# EAGLE design Chronograph (EAGLE 9.2.2)
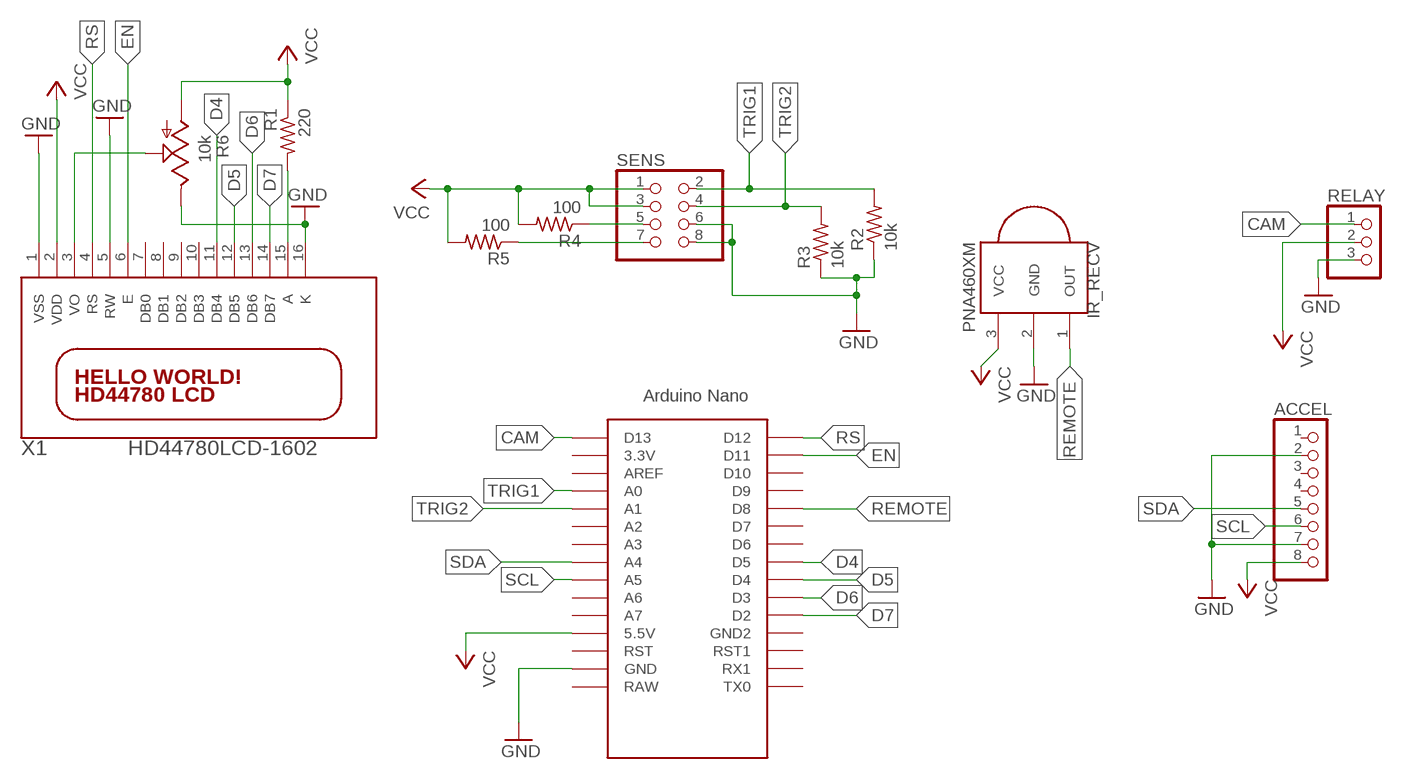
[diagram p0: schematic, sheet 1]

## Parts
ACCEL  PINHD-1X8BIG  [1X08-BIG]
IR_RECV  PNA460XM  [PNA460XM]
R1  220  R-US_0204/7  [0204/7]
R2  10k  R-US_0204/7  [0204/7]
R3  10k  R-US_0204/7  [0204/7]
R4  100  R-US_0204/7  [0204/7]
R5  100  R-US_0204/7  [0204/7]
R6  10k  TRIM_US-B64Y  [B64Y]
RELAY  PINHD-1X3  [1X03]
SENS  PINHD-2X4  [2X04]
U$1  NANO  [NANO]
X1  HD44780LCD-1602  [LCD1602]

## Nets
CAM: RELAY.1 U$1.D13
D4: U$1.D5 X1.11(DB4)
D5: U$1.D4 X1.12(DB5)
D6: U$1.D3 X1.13(DB6)
D7: U$1.D2 X1.14(DB7)
EN: U$1.D11 X1.6(E)
GRN: ACCEL.2 ACCEL.7 IR_RECV.2(GND) R2.1 R3.1 R6.E RELAY.3 SENS.6 SENS.8 U$1.GND X1.1(VSS) X1.5(RW) X1.16(K) ; supply symbol labelled GND
N$1: R1.2 X1.15(A)
N$2: R5.1 SENS.7
N$3: R4.1 SENS.5
N$4: R6.S X1.3(VO)
REMOTE: IR_RECV.1(OUT) U$1.D8
RS: U$1.D12 X1.4(RS)
SCL: ACCEL.6 U$1.A5
SDA: ACCEL.5 U$1.A4
TRIG1: R2.2 SENS.2 U$1.A0
TRIG2: R3.2 SENS.4 U$1.A1
VCC: ACCEL.8 IR_RECV.3(VCC) R1.1 R4.2 R5.2 R6.A RELAY.2 SENS.1 SENS.3 U$1.5V(5.5V) X1.2(VDD)
Unconnected: ACCEL.1 ACCEL.3 ACCEL.4 U$1.3.3V U$1.A2 U$1.A3 U$1.A6 U$1.A7 U$1.AREF U$1.D6 U$1.D7 U$1.D9 U$1.D10 U$1.GND1(GND2) U$1.ICSP1 U$1.ICSP2 U$1.ICSP3 U$1.ICSP4 U$1.ICSP5 U$1.ICSP6 U$1.RAW U$1.RST U$1.RST1 U$1.RX1 U$1.TX0 X1.7(DB0) X1.8(DB1) X1.9(DB2) X1.10(DB3)

## Library data of the parts
ACCEL = adafruit:PINHD-1X8: PIN HEADER
IR_RECV = adafruit:PNA460XM: IR 38KHz receiver PNA4602 and related receivers http://www.ladyada.net/library/pcb/eaglelibrary.html
R1-R5 = adafruit:R-US_: RESISTOR, American symbol
R6 = pot:TRIM_US-: POTENTIOMETER
RELAY = adafruit:PINHD-1X3: PIN HEADER
SENS = adafruit:PINHD-2X4: PIN HEADER
U$1 = Arduino-clone:NANO: Arduino Nano
X1 = adafruit:HD44780LCD: HD44780 LCD Standard character type LCDs, available in sizes from 8x1 to 40x4!

## Net classes
0 default: width 0.305 mm, drill 0.508 mm, clearance 0.254 mm

## Board
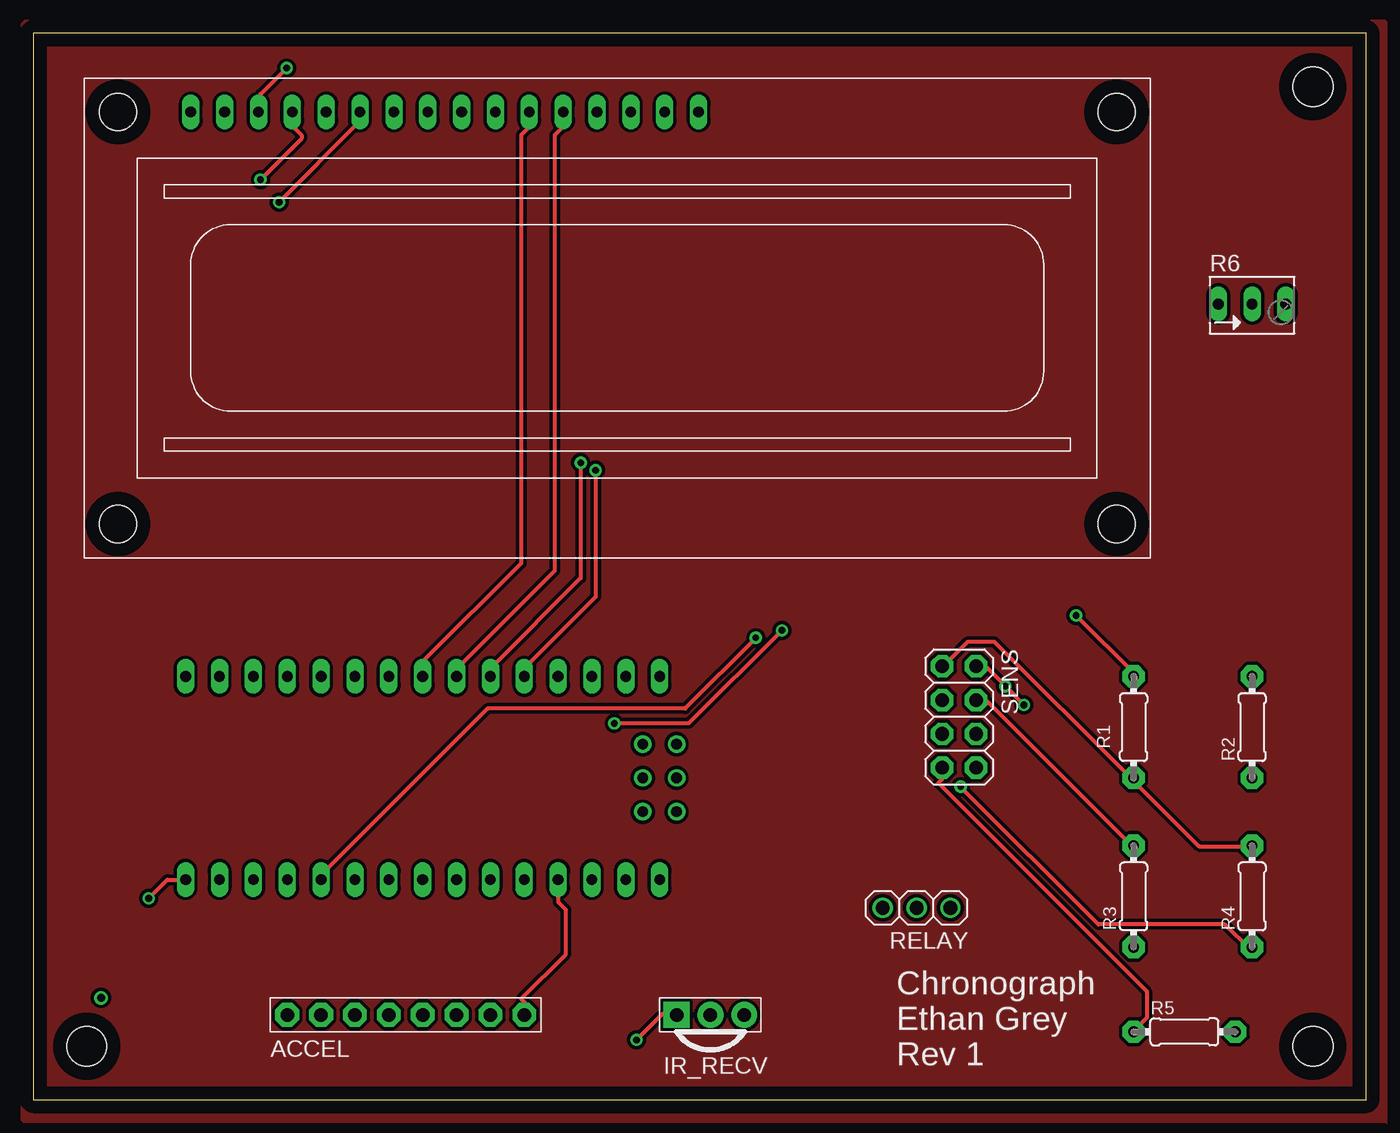
[diagram p1: board, top side]
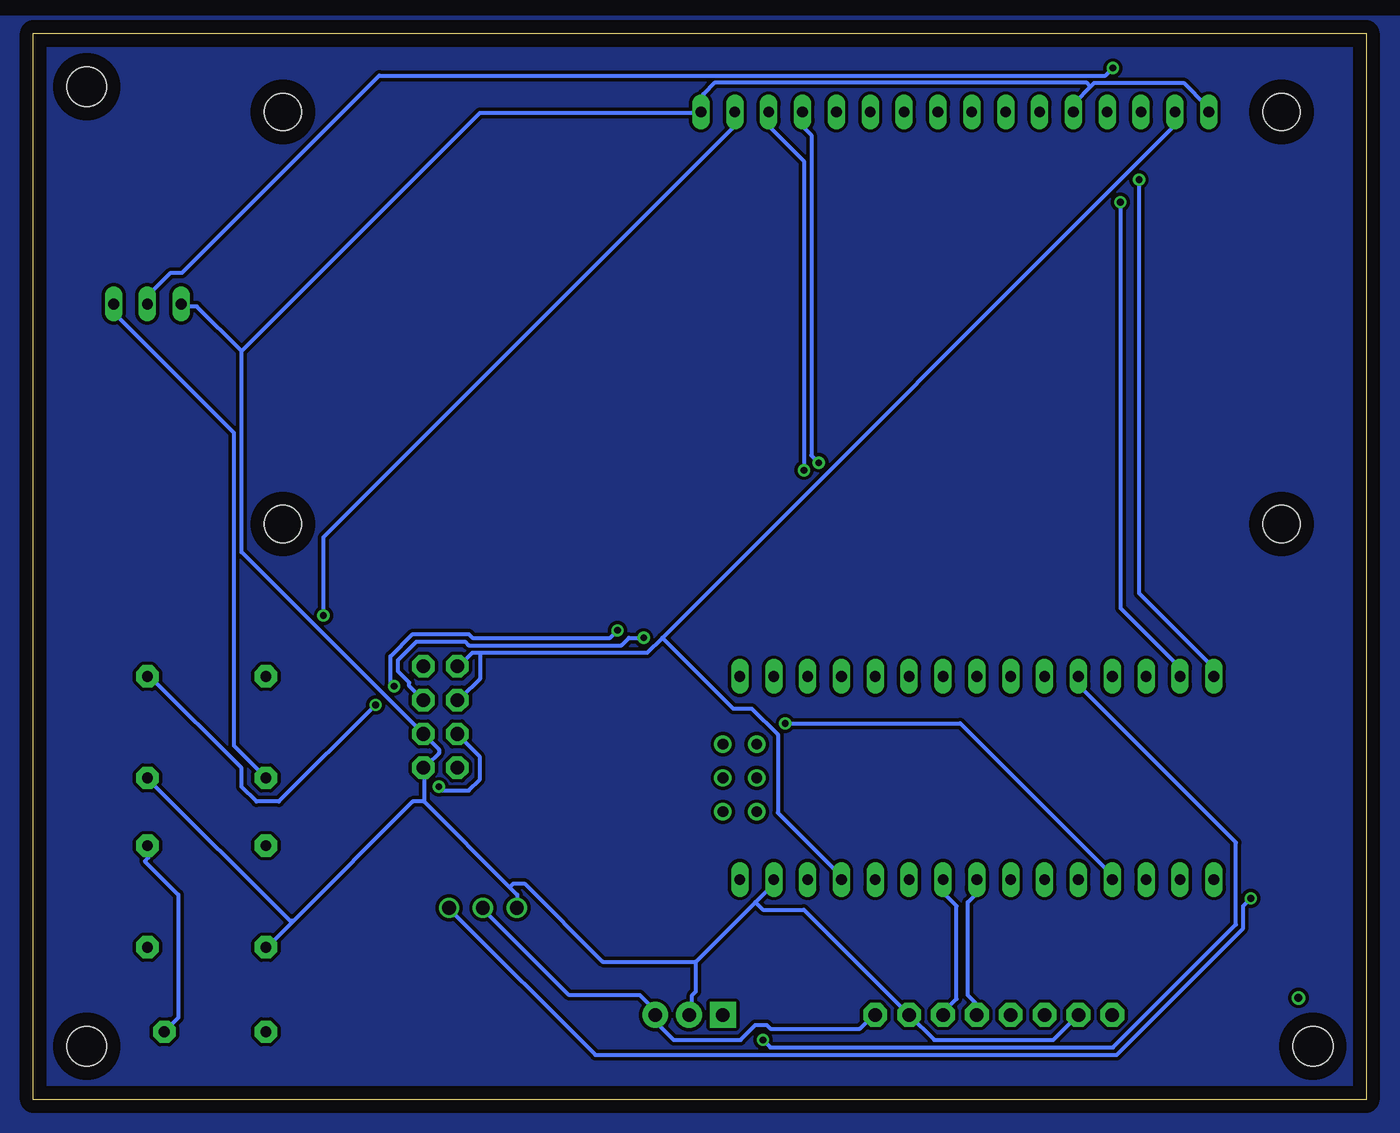
[diagram p2: board, bottom side, seen from below]

Size 100 x 80 mm. Coordinates in mm from the lower left corner, seen from the top.
Outline: 0,0 100,0 100,80 0,80 0,0
Copper layers (1*16): Top 0.035mm / dielectric 1.5mm / Bottom 0.035mm
Design rules "default": minimum track width 6mil, minimum drill 0.35mm, track to track 6mil, track to pad 6mil, pad to pad 6mil, via to via 6mil, smd to smd 6mil, copper to edge 40mil, drill to drill 6mil, minimum pad ring 10mil, minimum via ring 8mil, stop-mask expansion 4mil, vias tented up to drill 0mil, thermal gap 10mil
Holes 3 mm at 4,4 96,4 96,76

### Footprints (pad centres in the part's own frame; a part is rotated, then mirrored left to right if it is on the bottom)
1X08-BIG = drill 1.016 pad 1.778 octagon: 1 -8.89,0; 2 -6.35,0; 3 -3.81,0; 4 -1.27,0; 5 1.27,0; 6 3.81,0; 7 6.35,0; 8 8.89,0
PNA460XM = drill 1.016 pad 1.93 square: 1 -2.54,0 | drill 1.016 pad 1.93: 2 0,0; 3 2.54,0
0204/7 = drill 0.813 pad 1.676 octagon: 1 -3.81,0; 2 3.81,0
B64Y = drill 0.813 long: A 2.54,0; E -2.54,0; S 0,0
1X03 = drill 1.016: 1 -2.54,0; 2 0,0; 3 2.54,0
2X04 = drill 1.016 pad 1.676 octagon: 1 -3.81,-1.27; 2 -3.81,1.27; 3 -1.27,-1.27; 4 -1.27,1.27; 5 1.27,-1.27; 6 1.27,1.27; 7 3.81,-1.27; 8 3.81,1.27
NANO = drill 0.8 long: 3.3V -10.16,24.13; 5V -10.16,-1.27; A0 -10.16,19.05; A1 -10.16,16.51; A2 -10.16,13.97; A3 -10.16,11.43; A4 -10.16,8.89; A5 -10.16,6.35; A6 -10.16,3.81; A7 -10.16,1.27; AREF -10.16,21.59; D2 5.08,1.27; D3 5.08,3.81; D4 5.08,6.35; D5 5.08,8.89; D6 5.08,11.43; D7 5.08,13.97; D8 5.08,16.51; D9 5.08,19.05; D10 5.08,21.59; D11 5.08,24.13; D12 5.08,26.67; D13 -10.16,26.67; GND -10.16,-6.35; GND1 5.08,-1.27; RAW -10.16,-8.89; RST -10.16,-3.81; RST1 5.08,-3.81; RX1 5.08,-6.35; TX0 5.08,-8.89 | drill 0.8: ICSP1 -5.08,-10.16; ICSP2 -5.08,-7.62; ICSP3 -2.54,-10.16; ICSP4 -2.54,-7.62; ICSP5 0,-10.16; ICSP6 0,-7.62
LCD1602 = drill 0.8 long: 1 8,33.46; 2 10.54,33.46; 3 13.08,33.46; 4 15.62,33.46; 5 18.16,33.46; 6 20.7,33.46; 7 23.24,33.46; 8 25.78,33.46; 9 28.32,33.46; 10 30.86,33.46; 11 33.4,33.46; 12 35.94,33.46; 13 38.48,33.46; 14 41.02,33.46; 15 43.56,33.46; 16 46.1,33.46 | hole 2.8: 2.54,2.54; 2.54,33.46; 77.46,33.46; 77.46,2.54

### Placement (x,y rotation side)
ACCEL  27.94,6.35 0 top
IR_RECV  50.8,6.35 0 top
R1  82.55,27.94 90 top
R2  91.44,27.94 90 top
R3  82.55,15.24 90 top
R4  91.44,15.24 90 top
R5  86.36,5.08 0 top
R6  91.44,59.69 0 top
RELAY  66.26,14.38 180 top
SENS  69.47,28.7 270 top
U$1  38.1,26.67 90 top
X1  3.81,40.64 0 top

### Tracks (layer width: path | path; a pad name or v marks a point on that pad's centre or on a via)
CAM  (via drill 0.51)
  Top 0.305: v8.66,15.09 10.06,16.48 11.18,16.48 U$1.D13
  Bottom 0.305: v8.66,15.09 9.22,14.53 9.22,12.85 18.72,3.35 57.84,3.35 68.73,14.25 RELAY.1
D4
  Top 0.305: U$1.D5 29.34,31.85 29.34,32.97 36.6,40.23 36.6,72.36 37.16,72.92 37.16,74.04 X1.11
D5
  Top 0.305: U$1.D4 31.85,31.85 31.85,32.41 39.12,39.67 39.12,72.36 39.67,72.92 39.67,74.04 X1.12
D6  (via drill 0.51)
  Top 0.305: v41.07,47.78 41.07,39.12 34.37,32.41 34.37,31.85 U$1.D3
  Bottom 0.305: v41.07,47.78 41.63,48.34 41.63,72.36 42.19,72.92 42.19,74.04 X1.13
D7  (via drill 0.51)
  Top 0.305: v42.19,47.22 42.19,37.72 36.88,32.41 36.88,31.85 U$1.D2
  Bottom 0.305: v42.19,47.22 42.19,70.41 44.7,72.92 44.7,74.04 X1.14
EN  (via drill 0.51)
  Top 0.305: v18.44,67.33 24.31,73.2 24.31,74.04 X1.6
  Bottom 0.305: U$1.D11 13.97,32.41 18.44,36.88 v18.44,67.33
GND
  pour Top: -0.89,80.68 -0.89,-1.53 -0.76,-1.65 101.43,-1.65 101.56,-1.78 101.56,80.81 101.43,80.94 -0.63,80.94
  pour Bottom: -3.81,81.28 -3.81,-2.54 102.87,-2.54 102.87,81.28
GRN
  Bottom 0.305: ACCEL.2 23.47,4.47 32.41,4.47 ACCEL.7 42.19,14.25 45.26,14.25 45.82,14.81 | 50.29,10.34 45.82,14.81 | 45.82,14.81 44.7,15.93 44.7,16.48 U$1.GND | 50.29,10.34 50.29,8.1 50.57,7.82 50.57,6.43 IR_RECV.2 | 70.69,22.35 64.26,15.93 | 64.26,15.93 63.7,15.37 63.7,14.53 RELAY.3 | 70.69,22.35 70.69,24.87 SENS.8 70.69,25.15 70.41,25.15 69.57,25.98 69.57,26.26 SENS.6 70.69,27.66 70.97,27.94 71.25,27.94 84.38,41.07 84.38,56.16 | 80.47,13.41 71.53,22.35 70.69,22.35 | 80.47,13.41 82.42,11.46 R3.1 | 80.47,13.41 80.75,13.41 91.36,24.03 R2.1 | 50.29,10.34 57.28,10.34 63.14,16.2 63.98,16.2 64.26,15.93 | 20.68,76 21.79,74.88 21.79,74.32 X1.5 | 20.68,76 20.4,76.28 13.69,76.28 12.01,74.6 12.01,74.32 X1.1 | 20.68,76 20.95,76.28 48.9,76.28 49.73,75.44 49.73,74.32 X1.16 50.01,74.04 66.5,74.04 84.38,56.16 | 84.38,56.16 87.73,59.51 88.85,59.51 R6.E
N$1  (via drill 0.51)
  Top 0.305: v78.23,36.32 82.7,31.85 R1.2
  Bottom 0.305: v78.23,36.32 78.23,42.19 47.5,72.92 47.5,74.04 X1.15
N$2
  Top 0.305: R5.1 82.7,5.31 83.54,6.15 83.54,8.1 67.89,23.75 68.17,24.03 68.17,24.87 SENS.7
N$3  (via drill 0.51)
  Top 0.305: v69.57,23.47 79.91,13.13 89.41,13.13 91.36,11.18 R4.1
  Bottom 0.305: v69.57,23.47 69.29,23.19 67.33,23.19 66.5,24.03 66.5,25.7 68.17,27.38 SENS.5
N$4  (via drill 0.51)
  Top 0.305: v19,77.39 17.04,75.44 17.04,74.32 X1.3
  Bottom 0.305: v19,77.39 19.56,76.83 74.04,76.83 88.85,62.03 89.69,62.03 91.36,60.35 91.36,59.79 R6.S
N$6  (via drill 0.6)
  other vias: 5.08,7.62
REMOTE  (via drill 0.51)
  Top 0.305: v45.26,4.47 47.22,6.43 48.06,6.43 IR_RECV.1
  Bottom 0.305: v45.26,4.47 44.7,3.91 19,3.91 9.78,13.13 9.78,19.28 21.51,31.01 21.51,31.57 U$1.D8
RS  (via drill 0.51)
  Top 0.305: v17.04,69.01 20.12,72.08 20.12,72.36 19.56,72.92 19.56,74.04 X1.4
  Bottom 0.305: v17.04,69.01 17.04,38 11.46,32.41 11.46,31.85 U$1.D12
SCL
  Bottom 0.305: U$1.A5 31.57,16.48 31.57,15.37 30.73,14.53 30.73,7.54 31.85,6.43 ACCEL.6
SDA
  Bottom 0.305: U$1.A4 29.34,16.48 29.34,15.37 29.9,14.81 29.9,7.82 29.34,7.26 29.34,6.43 ACCEL.5
TRIG1  (via drill 0.51)
  Top 0.305: v43.59,28.22 49.17,28.22 v56.16,35.2 | SENS.2 70.97,32.41 71.53,32.41 v72.92,31.01 v74.32,29.62
  Bottom 0.305: v43.59,28.22 30.45,28.22 19.28,17.04 19.28,16.76 U$1.A0 | v56.16,35.2 56.72,34.65 67.06,34.65 67.33,34.92 71.53,34.92 73.2,33.25 73.2,31.29 v72.92,31.01 | v74.32,29.62 81.58,22.35 83.26,22.35 84.38,23.47 84.38,24.87 91.08,31.57 91.36,31.57 R2.2
TRIG2  (via drill 0.51)
  Top 0.305: v54.2,34.65 48.9,29.34 34.09,29.34 21.79,17.04 21.79,16.76 U$1.A1 | R3.2 82.42,19.28 82.14,19.28 71.53,29.9 70.97,29.9 SENS.4
  Bottom 0.305: v54.2,34.65 55.32,34.65 55.88,34.09 67.33,34.09 67.61,34.37 71.25,34.37 72.64,32.97 72.64,32.13 71.81,31.29 71.81,31.01 71.25,30.45 70.97,30.45 70.69,30.18 SENS.4
VCC
  Top 0.305: R4.2 91.36,19 87.45,19 82.42,24.03 R1.1 82.42,24.31 82.14,24.31 72.08,34.37 70.13,34.37 68.73,32.97 68.45,32.97 68.17,32.69 SENS.1 | U$1.5V 39.4,16.48 39.4,14.81 39.95,14.25 39.95,10.9 36.6,7.54 36.88,7.26 36.88,6.43 ACCEL.8
  Bottom 0.305: R5.2 89.97,5.31 89.13,6.15 89.13,15.37 91.64,17.88 91.36,18.16 91.36,19 R4.2 | R6.A 93.88,59.51 93.88,58.95 84.94,50.01 84.94,26.54 82.7,24.31 R1.1 | RELAY.2 66.22,14.25 59.79,7.82 54.48,7.82 53.09,6.43 IR_RECV.3 53.09,6.15 53.09,5.59 51.97,4.47 46.94,4.47 45.82,5.59 44.98,5.59 44.7,5.31 38,5.31 37.16,6.15 36.88,6.15 ACCEL.8 | 52.81,34.65 53.92,33.53 66.5,33.53 | 52.81,34.65 14.53,72.92 14.53,74.04 X1.2 | 66.5,33.53 67.06,33.53 68.17,32.41 SENS.1 | 66.5,33.53 66.5,31.57 67.89,30.18 68.17,30.18 SENS.3 | 52.81,34.65 47.5,29.34 46.1,29.34 44.15,27.38 44.15,21.51 39.4,16.76 U$1.5V

### Text on the board
tNames: Chronograph / Ethan Grey / Rev 1
tValues: + - | Trig 1 / Trig 2 / LED 1 / LED2 | - + S | S - + | - / / / SDA / SCL / - / +